# Altium schematic sheet 1.POWER.SchDoc: POWER
size A3; DrawnBy: AYTAC DILEK; SheetNumber: 1; SheetTotal: 16
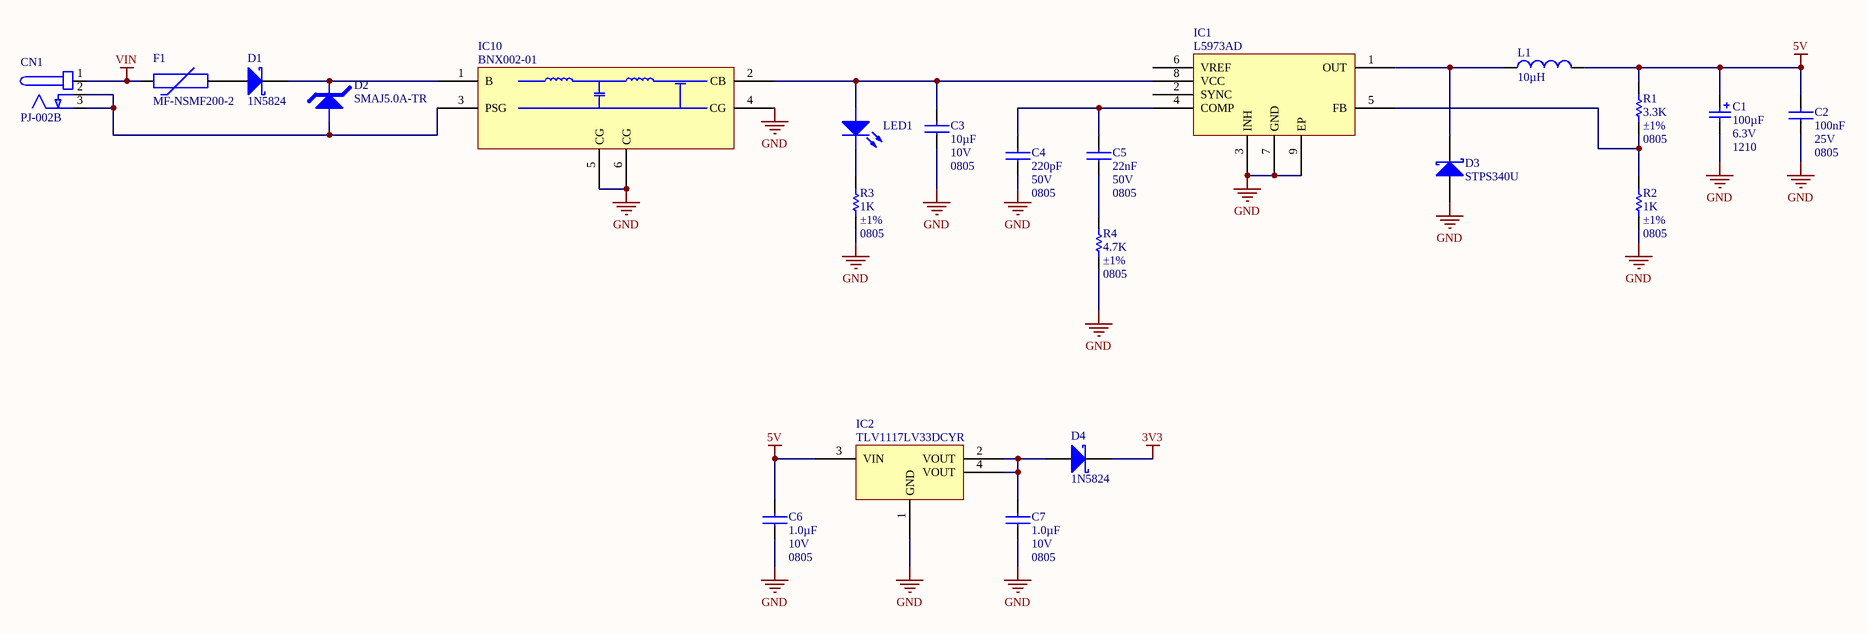
[diagram p0: 1.POWER.SchDoc]

## Parts
C1  Capacitance: 100µF  Voltage - Rated: 6.3V  Package / Case: 1210  [CAPMP3528X19N_EIA-1210_CASE-B]  (hidden comment: CAP_P)
C2  Capacitance: 100nF  Voltage - Rated: 25V  Package / Case: 0805  [CAPC2012X100N_EIA0805]  (hidden comment: CAP_NP)
C3  Capacitance: 10µF  Voltage - Rated: 10V  Package / Case: 0805  [CAPC2012X100N_EIA0805]  (hidden comment: CAP_NP)
C4  Capacitance: 220pF  Voltage - Rated: 50V  Package / Case: 0805  [CAPC2012X100N_EIA0805]  (hidden comment: CAP_NP)
C5  Capacitance: 22nF  Voltage - Rated: 50V  Package / Case: 0805  [CAPC2012X100N_EIA0805]  (hidden comment: CAP_NP)
C6  Capacitance: 1.0µF  Voltage - Rated: 10V  Package / Case: 0805  [CAPC2012X100N_EIA0805]  (hidden comment: CAP_NP)
C7  Capacitance: 1.0µF  Voltage - Rated: 10V  Package / Case: 0805  [CAPC2012X100N_EIA0805]  (hidden comment: CAP_NP)
CN1  Manufacturer Part Number: PJ-002B  [DC_JACK]  (hidden comment: DC_JACK)
D1  value 1N5824  [DIOM4436X24N_DO-214AA_SMB]  (hidden comment: DIODE_SCHOTTKY)
D2  value SMAJ5.0A-TR  [DIOM5126X26N_DO-214AC_SMA]  (hidden comment: DIODE_TVS_UNI)
D3  value STPS340U  [DIOM4436X24N_DO-214AA_SMB]  (hidden comment: DIODE_SCHOTTKY)
D4  value 1N5824  [DIOM4436X24N_DO-214AA_SMB]  (hidden comment: DIODE_SCHOTTKY)
F1  Manufacturer Part Number: MF-NSMF200-2  [FUSEC3216X16N]  (hidden comment: PTC)
IC1  L5973AD  [SOP127P600X200_HS-9N]
IC2  TLV1117LV33DCYR  [SOT230P700X180-4N_[TEXAS]R-PDSO-G4]
IC10  BNX002-01  [MURATA_BNX002-01]
L1  value 10µH  [TDK_SLF10145T-100M2R5-PF]  (hidden comment: INDUCTOR)
LED1  LED  [LEDC2012X70N_EIA0805_GREEN]  (value not drawn)
R1  value 3.3K  Tolerance: ±1%  Package / Case: 0805  [RESC2013X65N_EIA0805]  (hidden comment: RES)
R2  value 1K  Tolerance: ±1%  Package / Case: 0805  [RESC2013X65N_EIA0805]  (hidden comment: RES)
R3  value 1K  Tolerance: ±1%  Package / Case: 0805  [RESC2013X65N_EIA0805]  (hidden comment: RES)
R4  value 4.7K  Tolerance: ±1%  Package / Case: 0805  [RESC2013X65N_EIA0805]  (hidden comment: RES)

## Nets
3V3: D4.1
5V: C1.1 C2.2 C6.2 IC2.3(VIN) L1.2 R1.1
GND: C1.2 C2.1 C3.1 C4.1 C6.1 C7.1 D3.2 IC1.3(INH) IC1.7(GND) IC1.9(EP) IC2.1(GND) IC10.4(CG) IC10.5(CG) IC10.6(CG) R2.2 R3.2 R4.2
VIN: CN1.1(+) F1.1
NetC3_2: C3.2 IC1.8(VCC) IC10.2(CB) LED1.2
NetC4_2: C4.2 C5.2 IC1.4(COMP)
NetC5_1: C5.1 R4.1
NetC7_2: C7.2 D4.2 IC2.2(VOUT) IC2.4(VOUT)
NetCN1_2: CN1.2(GND) CN1.3(GND) D2.2 IC10.3(PSG)
NetD1_1: D1.1 D2.1 IC10.1(B)
NetD1_2: D1.2 F1.2
NetD3_1: D3.1 IC1.1(OUT) L1.1
NetIC1_5: IC1.5(FB) R1.2 R2.1
NetLED1_1: LED1.1 R3.1

Not connected (* = marked no-connect by the designer): IC1 2(SYNC) 6(VREF)

## Library data of the parts
C1 = SCAP01400007: CAP TANT 100UF 6.3V 20% 1210; Manufacturer: AVX Corporation; Manufacturer Part Number: TAJB107M006RNJ; ESR (Equivalent Series Resistance): 1.7 Ohm; Type: Molded; Cost x1 ($): 1.25000; Cost x10 ($): 1.02500; Cost x100 ($): 0.72500; Cost x1000 ($): 0.47500; Distrubutor: Digikey; Part Number: SCAP01400007; Value: 100uF; Tolerance: ±20%; Operating Temperature: -55°C ~ 125°C; Category: Capacitors; Family: Tantalum Capacitors; Distributor Part Number: 478-3877-1-ND; Distributor Link: http://www.digikey.com/product-detail/en/TAJB107M006RNJ/478-3877-1-ND/1126923; ROHS: YES; Quantity: 10
C2 = SCAP00300093: CAP CER 0.1UF 25V X7R 0805; Manufacturer: Samsung Electro-Mechanics America, Inc.; Manufacturer Part Number: CL21B104KACNNNC; Value: 100nF; Tolerance: ±10%; Type: Multi Layer Ceramic Capacitor  (MLCC); Cost x1 ($): 0.10000; Cost x10 ($): 0.03300; Cost x100 ($): 0.01470; Cost x1000 ($): 0.00825; Distrubutor: Digikey; Lead Time: 11 Weeks; Part Number: SCAP00300093; Temperature Coefficient: X7R; Operating Temperature: -55°C ~ 125°C; Mounting Type: Surface Mount, MLCC; Size / Dimension: 0.079" L x 0.049" W (2.00mm x 1.25mm); Category: Capacitors; Family: Ceramic Capacitors; Distributor Part Number: 1276-1099-1-ND; Distributor Link: http://www.digikey.com/product-detail/en/samsung-electro-mechanics-america-inc/CL21B104KACNNNC/1276-1099-1-ND/3889185; ROHS: YES; Moisture Sensitivity Level (MSL): 1 (Unlimited); Quantity: 50
C3 = SCAP00300106: CAP CER 10UF 10V X5R 0805; Manufacturer: Samsung Electro-Mechanics America, Inc; Manufacturer Part Number: CL21A106KPFNNNE; Tolerance: ±10%; Type: Multi Layer Ceramic Capacitor  (MLCC); Cost x1 ($): 0.18000; Cost x10 ($): 0.13000; Cost x100 ($): 0.06090; Cost x1000 ($): 0.03535; Distrubutor: Digikey; Lead Time: 11 Weeks; Part Number: SCAP00300106; Value: 10uF; Temperature Coefficient: X5R; Operating Temperature: -55°C ~ 85°C; Mounting Type: Surface Mount, MLCC; Size / Dimension: 0.079" L x 0.049" W (2.00mm x 1.25mm); Category: Capacitors; Family: Ceramic Capacitors; Distributor Part Number: 1276-1052-1-ND; Distributor Link: http://www.digikey.com/product-detail/en/samsung-electro-mechanics-america-inc/CL21A106KPFNNNE/1276-1052-1-ND/3889138; ROHS: YES; Moisture Sensitivity Level (MSL): 1 (Unlimited); Quantity: 50
C4 = SCAP00300066: CAP CER 220PF 50V X7R 0805; Manufacturer: Samsung Electro-Mechanics America, Inc.; Manufacturer Part Number: CL21B221KBANNNC; Tolerance: ±10%; Type: Multi Layer Ceramic Capacitor  (MLCC); Cost x1 ($): 0.10000; Cost x10 ($): 0.04700; Cost x100 ($): 0.02100; Cost x1000 ($): 0.01180; Distrubutor: Digikey; Lead Time: 11 Weeks; Part Number: SCAP00300066; Value: 220pF; Temperature Coefficient: X7R; Operating Temperature: -55°C ~ 125°C; Mounting Type: Surface Mount, MLCC; Size / Dimension: 0.079" L x 0.049" W (2.00mm x 1.25mm); Category: Capacitors; Family: Ceramic Capacitors; Distributor Part Number: 1276-2474-1-ND; Distributor Link: http://www.digikey.com/product-detail/en/samsung-electro-mechanics-america-inc/CL21B221KBANNNC/1276-2474-1-ND/3890560; ROHS: YES; Moisture Sensitivity Level (MSL): 1 (Unlimited); Quantity: 50
C5 = SCAP00300087: CAP CER 0.022UF 50V X7R 0805; Manufacturer: Samsung Electro-Mechanics America, Inc.; Manufacturer Part Number: CL21B223KBANNNC; Value: 22nF; Tolerance: ±10%; Type: Multi Layer Ceramic Capacitor  (MLCC); Cost x1 ($): 0.10000; Cost x10 ($): 0.05800; Cost x100 ($): 0.02600; Cost x1000 ($): 0.01458; Distrubutor: Digikey; Lead Time: 11 Weeks; Part Number: SCAP00300087; Temperature Coefficient: X7R; Operating Temperature: -55°C ~ 125°C; Mounting Type: Surface Mount, MLCC; Size / Dimension: 0.079" L x 0.049" W (2.00mm x 1.25mm); Category: Capacitors; Family: Ceramic Capacitors; Distributor Part Number: 1276-1081-1-ND; Distributor Link: http://www.digikey.com/product-detail/en/samsung-electro-mechanics-america-inc/CL21B223KBANNNC/1276-1081-1-ND/3889167; ROHS: YES; Moisture Sensitivity Level (MSL): 1 (Unlimited); Quantity: 50
C6 C7 = SCAP00300099: CAP CER 1UF 10V X7R 0805; Manufacturer: Samsung Electro-Mechanics America, Inc.; Manufacturer Part Number: CL21B105KPFNNNE; Value: 1.0uF; Tolerance: ±10%; Type: Multi Layer Ceramic Capacitor  (MLCC); Cost x1 ($): 0.10000; Cost x10 ($): 0.06100; Cost x100 ($): 0.02700; Cost x1000 ($): 0.01513; Distrubutor: Digikey; Lead Time: 11 Weeks; Part Number: SCAP00300099; Temperature Coefficient: X7R; Operating Temperature: -55°C ~ 125°C; Mounting Type: Surface Mount, MLCC; Size / Dimension: 0.079" L x 0.049" W (2.00mm x 1.25mm); Category: Capacitors; Family: Ceramic Capacitors; Distributor Part Number: 1276-1275-1-ND; Distributor Link: http://www.digikey.com/product-detail/en/samsung-electro-mechanics-america-inc/CL21B105KPFNNNE/1276-1275-1-ND/3889361; ROHS: YES; Moisture Sensitivity Level (MSL): 1 (Unlimited); Quantity: 50
CN1 = SCON00027: CONN POWER JACK MALE 2.5MM CLSD; Manufacturer: CUI Inc; Voltage: 24VDC; Current: 2.5A; Distrubutor: Digikey; Lead Time: 10 Weeks; Cost x1 ($): 0.93000; Cost x10 ($): 0.65100; Cost x100 ($): 0.43710; Cost x1000 ($): 0.31620; Part Number: SCON00027; Value: DC_JACK; Category: Connectors, Interconnects; Family: Barrel - Power Connectors; Connector Type: Jack; Contact Type: Male; Mounting Type: Through Hole, Right Angle; Packaging: Bulk; Contact Finish: Silver; Distributor Part Number: CP-002B-ND; Datasheet Link: http://www.digikey.com/product-detail/en/PJ-002B/CP-002B-ND/96965; ROHS: YES; Moisture Sensitivity Level (MSL): 1 (Unlimited); Part Status: Active; Quantity: 20
D1 D4 = SSEM00019: DIODE SCHOTTKY 5A 40V SMA; Manufacturer: Micro Commercial Co; Manufacturer Part Number: SK54B-LTP; Distrubutor: Digikey; Lead Time: 1 (Unlimited); Cost x10 ($): 0.42000; Cost x100 ($): 0.28840; Cost x1000 ($): 0.14832; Cost x1 ($): 0.54000; Part Number: SSEM00019; Category: Discrete Semiconductor Products; Family: Diodes - Rectifiers - Single; Package / Case: DO-214AA, SMB; Type: Schottky; Distributor Part Number: SK54B-LTPMSCT-ND; ROHS: YES; Datasheet Link: http://www.digikey.com/product-detail/en/micro-commercial-co/SK54B-LTP/SK54B-LTPMSCT-ND/5865087; Moisture Sensitivity Level (MSL): 8 Weeks; Quantity: 0
D2 = SCP00004: TVS DIODE 5VWM 13.4VC DO214AC; Manufacturer: STMicroelectronics; Voltage - Reverse Standoff (Typ): 5V; Voltage - Breakdown (Min): 6.4V; Power - Peak Pulse: 400W; Type: Zener; Cost x10 ($): 0.29600; Cost x100 ($): 0.18420; Cost x1000 ($): 0.09682; Distrubutor: Digikey; Lead Time: 11 Weeks; Cost x1 ($): 0.39000; Part Number: SCP00004; Category: Circuit Protection; Family: TVS - Diodes; Package / Case: DO-214AC, SMA; Manufacturer Part Number: SMAJ5.0A-TR; Distributor Part Number: 497-2999-1-ND; ROHS: YES; Datasheet Link: http://www.digikey.com/product-detail/en/stmicroelectronics/SMAJ5.0A-TR/497-2999-1-ND/634866; Moisture Sensitivity Level (MSL): 1 (Unlimited); Quantity: 0
D3 = SSEM00020: DIODE SCHOTTKY 40V 3A SMB; Manufacturer: STMicroelectronics; Cost x10 ($): 0.39500; Cost x100 ($): 0.29480; Cost x1000 ($): 0.17850; Distrubutor: Digikey; Lead Time: 1 (Unlimited); Cost x1 ($): 0.46000; Part Number: SSEM00020; Category: Discrete Semiconductor Products; Family: Diodes - Rectifiers - Single; Package / Case: DO-214AA, SMB; Type: Schottky; Manufacturer Part Number: STPS340U; Distributor Part Number: 497-2465-1-ND; ROHS: YES; Datasheet Link: http://www.digikey.com/product-detail/en/stmicroelectronics/STPS340U/497-2465-1-ND/603847; Part Status: Active; Quantity: 0
F1 = SCP00008: FUSE RESETTABLE 2.0A HOLD SMD; Manufacturer: Bourns Inc.; Value: MF-NSMF200-2; Cost x10 ($): 0.56100; Cost x100 ($): 0.39270; Cost x1000 ($): 0.26690; Distrubutor: Digikey; Lead Time: 10 Weeks; Cost x1 ($): 0.60000; Part Number: SCP00008; Category: Circuit Protection; Family: PTC Resettable Fuses; Package / Case: 1206 (3216 Metric), Concave, Long Side Terminals; Distributor Part Number: MF-NSMF200-2CT-ND; ROHS: YES; Datasheet Link: http://www.digikey.com/product-detail/en/bourns-inc/MF-NSMF200-2/MF-NSMF200-2CT-ND/1232791; Moisture Sensitivity Level (MSL): 1 (Unlimited); Quantity: 100; Part Status: Active
IC1 = SIC00116: IC REG BUCK ADJ 2A 8SOIC; Manufacturer: STMicroelectronics; Vin: 4 V ~ 36 V; Speed: 500kHz; Cost x10 ($): 1.98800; Cost x100 ($): 1.59750; Cost x1000 ($): 1.08750; Distrubutor: Digikey; Lead Time: 12 Weeks; Cost x1 ($): 2.21000; Part Number: SIC00116; Manufacturer Part Number: L5973AD; Value: L5973AD; Iout: 2A; Operating Temperature: -40°C ~ 150°C (TJ); Category: Integrated Circuits (ICs); Family: PMIC - Voltage Regulators - DC DC Switching Regulators; Package / Case: 8-SOIC (0.154", 3.90mm Width) Exposed Pad; Type: Buck; Distributor Part Number: 497-4565-5-ND; ROHS: YES; Distributor Link: http://www.digikey.com/product-detail/en/stmicroelectronics/L5973AD/497-4565-5-ND/585938; MSL: 3 (168 Hours); Quantity: 0
IC2 = SIC00137: IC REG LDO 3.3V 1A SOT223; Manufacturer: Texas Instruments; Vin: Up to 5.5V; Iout: 1.1A; Cost x10 ($): 0.56400; Cost x100 ($): 0.43160; Cost x1000 ($): 0.27390; Distrubutor: Digikey; Lead Time: 6 Weeks; Cost x1 ($): 0.64000; Part Number: SIC00137; Manufacturer Part Number: TLV1117LV33DCYR; Value: TLV1117LV33DCYR; Vout: 3.3V; Operating Temperature: -40°C ~ 125°C; Category: Integrated Circuits (ICs); Family: PMIC - Voltage Regulators - Linear; Package / Case: SOT-223-4, TO-261-4, TO-261AA; Type: Positive Fixed; Distributor Part Number: 296-28778-1-ND; ROHS: YES; Distributor Link: http://www.digikey.com/product-detail/en/texas-instruments/TLV1117LV33DCYR/296-28778-1-ND/2666520; MSL: 1 (Unlimited); Quantity: 0
IC10 = SFIL00006: FILTER LC TH; Manufacturer: Murata Electronics North America; Current Rating: 10A; Value: LC_FILTER; Cost x10 ($): 7.62800; Cost x100 ($): 4.91550; Cost x1000 ($): 4.23750; Distrubutor: Digikey; Lead Time: 7 Weeks; Cost x1 ($): 8.48000; Part Number: SFIL00006; Type: Low Pass; Package / Case: Block, 4 Lead; Category: Filters; Family: EMI/RFI Filters (LC, RC Networks); Manufacturer Part Number: BNX002-01; Distributor Part Number: 490-5053-ND; ROHS: YES; Datasheet Link: http://www.digikey.com/product-detail/en/murata-electronics-north-america/BNX002-01/490-5053-ND/1825574; Quantity: 0
L1 = SIND00006: FIXED IND 10UH 2.5A 43.7 MOHM; Manufacturer: TDK Corporation; Manufacturer Part Number: SLF10145T-100M2R5-PF; Tolerance: ±20%; DC Resistance (DCR): 43.7 mOhm Max; Type: Wirewound; Cost x10 ($): 1.12500; Cost x100 ($): 0.85500; Distrubutor: Digikey; Lead Time: 14 Weeks; Cost x1 ($): 1.20000; Part Number: SIND00006; Inductance: 10µH; Package / Case: Nonstandard; Operating Temperature: -40°C ~ 105°C; Current Rating: 2.5A; Category: Inductors, Coils, Chokes; Family: Fixed Inductors; Cost x1000 ($): 0.85500; Distributor Part Number: 445-1975-1-ND; Distributor Link: http://www.digikey.com/product-detail/en/tdk-corporation/SLF10145T-100M2R5-PF/445-1975-1-ND/755382; ROHS: YES; Moisture Sensitivity Level (MSL): 1 (Unlimited); Quantity: 0
LED1 = SOPT00002: LED GREEN CLEAR THIN 0805 SMD; Manufacturer: Lite-On Inc; Manufacturer Part Number: LTST-C171KGKT; Value: LED_GREEN; Cost x10 ($): 0.24800; Cost x100 ($): 0.13500; Cost x1000 ($): 0.05850; Distrubutor: Digikey; Cost x1 ($): 0.32000; Part Number: SOPT00002; Package / Case: 0805 (2012 Metric); Category: Optoelectronics; Family: LED Indication - Discrete; Type: LED; Distributor Part Number: 160-1426-1-ND; ROHS: YES; Datasheet Link: http://www.digikey.com/product-detail/en/LTST-C171KGKT/160-1426-1-ND/386798; Quantity: 124
R1 = SRES03010086: RES SMD 3.3K OHM 1% 1/8W 0805; Manufacturer: Yageo; Manufacturer Part Number: RC0805FR-073K3L; Power (Watts): 0.125W, 1/8W; Cost x1 ($): 0.10; Cost x10 ($): 0.21; Cost x100 ($): 0.84; Cost x1000 ($): 3.79; Distrubutor: Digikey; Part Number: SRES03010086; Resistance (Ohm): 3.3K; Category: Resistors; Family: Chip Resistor - Surface Mount; Distributor Part Number: 311-3.30KCRCT-ND; Distributor Link: http://www.digikey.com/product-detail/en/RC0805FR-073K3L/311-3.30KCRCT-ND/730760; ROHS: YES; Quantity: 0
R2 R3 = SRES03010074: RES SMD 1K OHM 1% 1/8W 0805; Manufacturer: Yageo; Manufacturer Part Number: RC0805FR-071KL; Power (Watts): 0.125W, 1/8W; Cost x1 ($): 0.10; Cost x10 ($): 0.21; Cost x100 ($): 0.84; Cost x1000 ($): 3.79; Distrubutor: Digikey; Part Number: SRES03010074; Resistance (Ohm): 1K; Category: Resistors; Family: Chip Resistor - Surface Mount; Distributor Part Number: 311-1.00KCRCT-ND; Distributor Link: http://www.digikey.com/product-detail/en/RC0805FR-071KL/311-1.00KCRCT-ND/730391; ROHS: YES; Quantity: 0
R4 = SRES03010090: RES SMD 4.7K OHM 1% 1/8W 0805; Manufacturer: Yageo; Manufacturer Part Number: RC0805FR-074K7L; Power (Watts): 0.125W, 1/8W; Cost x1 ($): 0.10; Cost x10 ($): 0.21; Cost x100 ($): 0.84; Cost x1000 ($): 3.79; Distrubutor: Digikey; Part Number: SRES03010090; Resistance (Ohm): 4.7K; Category: Resistors; Family: Chip Resistor - Surface Mount; Distributor Part Number: 311-4.70KCRCT-ND; Distributor Link: http://www.digikey.com/product-detail/en/RC0805FR-074K7L/311-4.70KCRCT-ND/730876; ROHS: YES; Quantity: 0